# EAGLE design ir_ring_2019_05 (EAGLE 6.5.0)
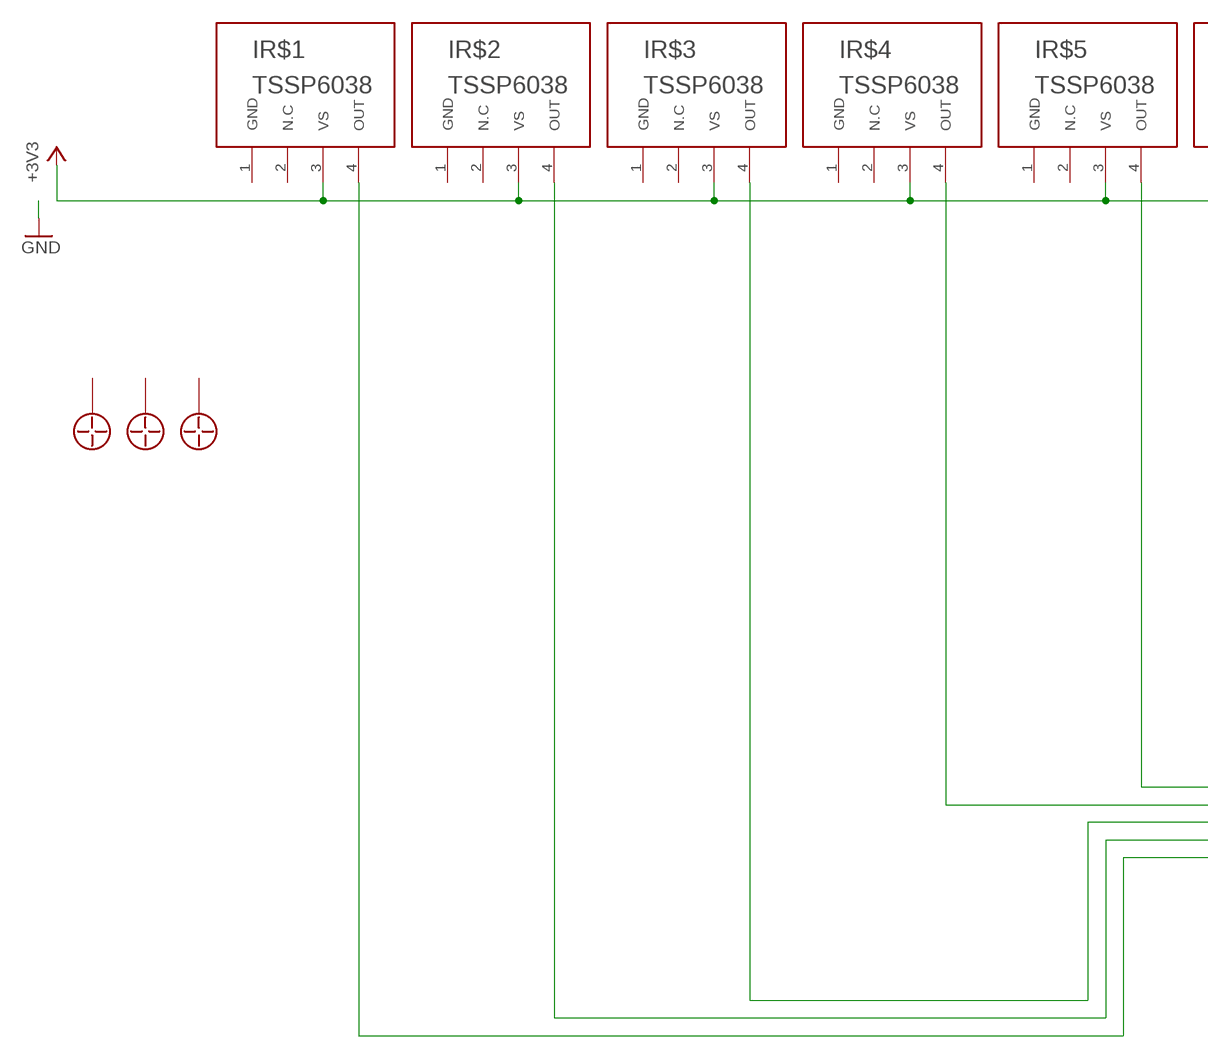
[diagram p0: schematic, sheet 1, part 1 of 2]
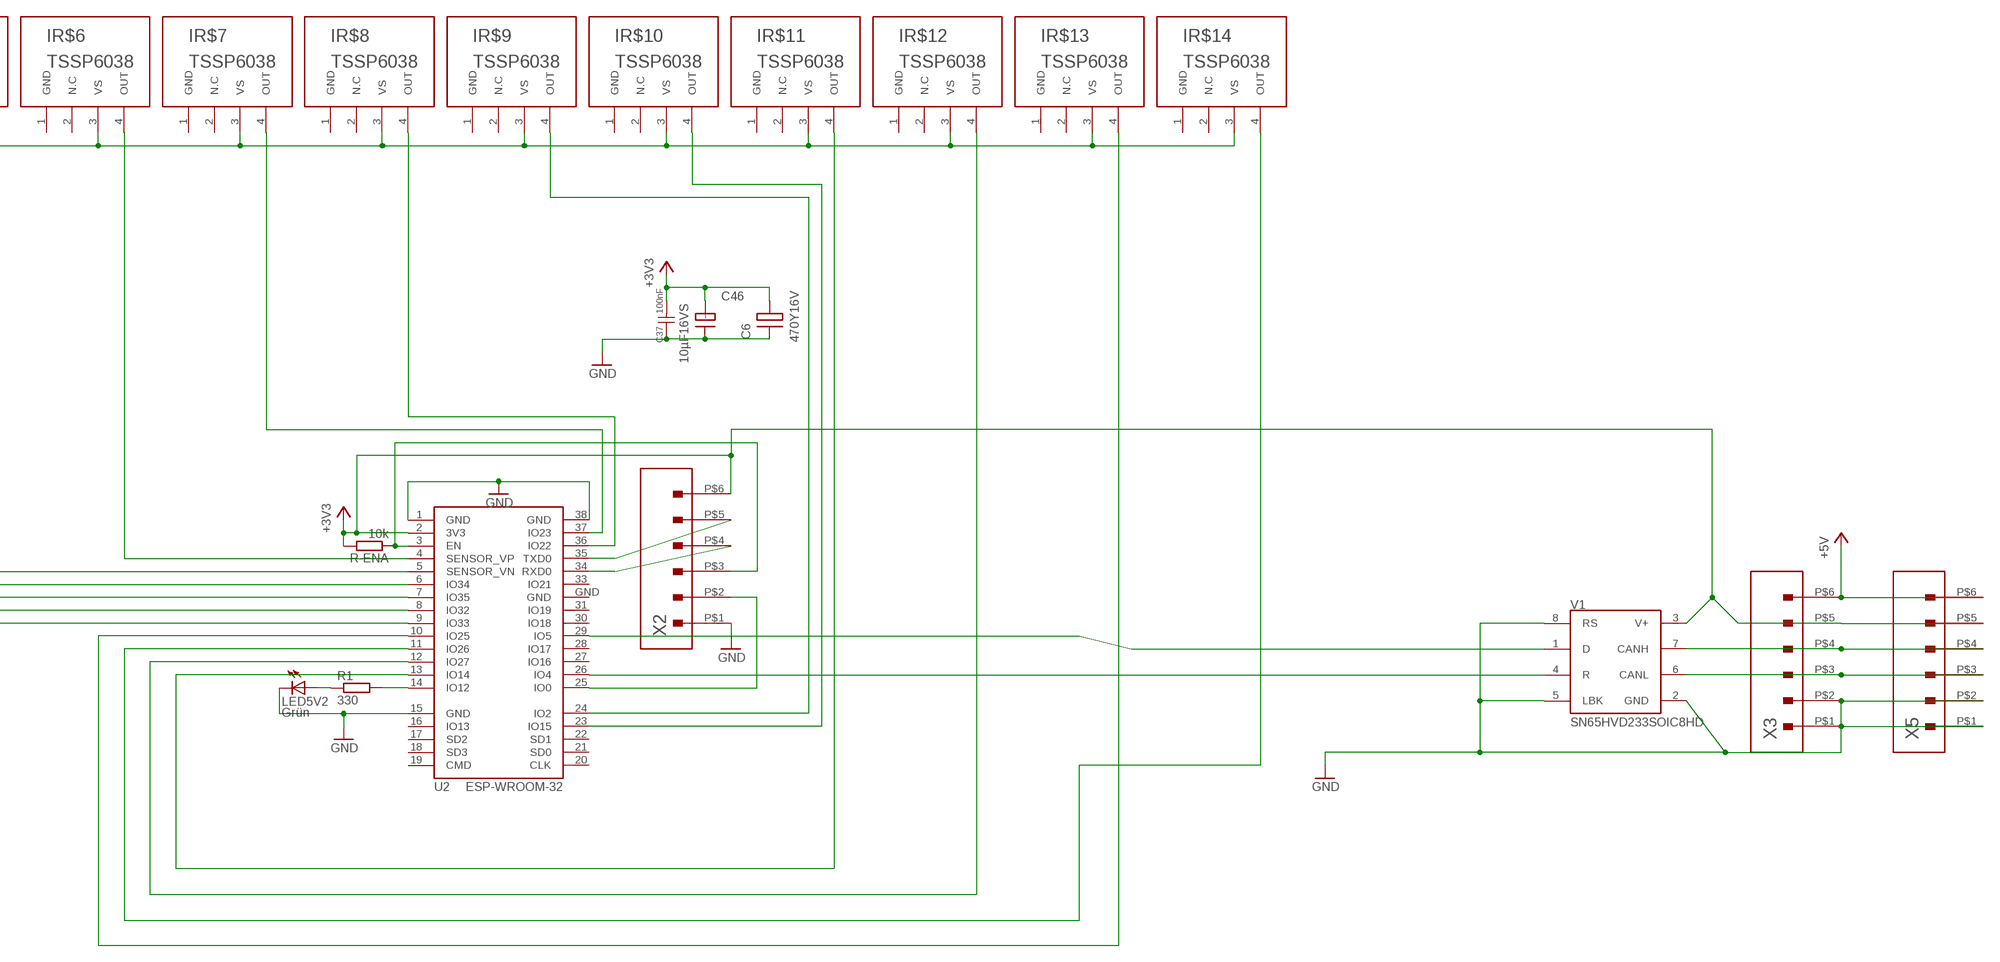
[diagram p1: schematic, sheet 1, part 2 of 2]

## Parts
C6  470Y16V  [150CLZ-1010]
C37  100nF  C0805  [0805]
C46  10µF16VS  [TANTALC]
IR$1  TSSP6038  [TSSP6038]
IR$2  TSSP6038  [TSSP6038]
IR$3  TSSP6038  [TSSP6038]
IR$4  TSSP6038  [TSSP6038]
IR$5  TSSP6038  [TSSP6038]
IR$6  TSSP6038  [TSSP6038]
IR$7  TSSP6038  [TSSP6038]
IR$8  TSSP6038  [TSSP6038]
IR$9  TSSP6038  [TSSP6038]
IR$10  TSSP6038  [TSSP6038]
IR$11  TSSP6038  [TSSP6038]
IR$12  TSSP6038  [TSSP6038]
IR$13  TSSP6038  [TSSP6038]
IR$14  TSSP6038  [TSSP6038]
LED5V2  Grün  LEDCHIP-LED0805  [CHIP-LED0805]
PM1  SMD-PASSER-1MMR  [SMD-PASSER-1MMR]
PM2  SMD-PASSER-1MMR  [SMD-PASSER-1MMR]
PM3  SMD-PASSER-1MMR  [SMD-PASSER-1MMR]
R1  330  R-EU_R0805  [R0805]
R-ENA  10k  R-EU_R0805  [R0805]
U2  ESP-WROOM-32  [ESP-WROOM-32]
V1  SN65HVD233SOIC8HD  [SO08]
X2  MOLEX104078-0610  [MOLEX104078-0610]
X3  MOLEX104078-0610  [MOLEX104078-0610]
X5  MOLEX104078-0610  [MOLEX104078-0610]

## Nets
+3V3: C6.+ C37.1 C46.+ IR$1.3(VS) IR$2.3(VS) IR$3.3(VS) IR$4.3(VS) IR$5.3(VS) IR$6.3(VS) IR$7.3(VS) IR$8.3(VS) IR$9.3(VS) IR$10.3(VS) IR$11.3(VS) IR$12.3(VS) IR$13.3(VS) IR$14.3(VS) R-ENA.2 U2.2(3V3) V1.3(V+) X2.P$6 X3.P$5 X5.P$5
+5V: X3.P$6 X5.P$6
GND: C6.- C37.2 C46.- LED5V2.C U2.1(GND) U2.15(GND) U2.38(GND) V1.2(GND) V1.5(LBK) V1.8(RS) X2.P$1 X3.P$1 X3.P$2 X5.P$1 X5.P$2
N$1: IR$3.4(OUT) U2.7(IO35)
N$2: IR$2.4(OUT) U2.8(IO32)
N$3: IR$1.4(OUT) U2.9(IO33)
N$4: IR$12.4(OUT) U2.12(IO27)
N$5: IR$11.4(OUT) U2.13(IO14)
N$6: IR$10.4(OUT) U2.23(IO15)
N$7: IR$9.4(OUT) U2.24(IO2)
N$8: IR$13.4(OUT) U2.10(IO25)
N$9: IR$6.4(OUT) U2.4(SENSOR_VP)
N$10: IR$5.4(OUT) U2.5(SENSOR_VN)
N$11: IR$4.4(OUT) U2.6(IO34)
N$12: IR$7.4(OUT) U2.37(IO23)
N$13: IR$8.4(OUT) U2.36(IO22)
N$14: U2.26(IO4) V1.4(R)
N$15: U2.29(IO5) V1.1(D)
N$17: V1.7(CANH) X3.P$4 X5.P$4
N$18: V1.6(CANL) X3.P$3 X5.P$3
N$20: LED5V2.A R1.1
N$21: R1.2 U2.14(IO12)
N$33: R-ENA.1 U2.3(EN) X2.P$3
N$35: U2.25(IO0) X2.P$2
RX: U2.34(RXD0) X2.P$4
TX: U2.35(TXD0) X2.P$5
WS6: IR$14.4(OUT) U2.11(IO26)
Unconnected: IR$1.2(N.C) IR$2.2(N.C) IR$3.2(N.C) IR$4.2(N.C) IR$5.2(N.C) IR$6.2(N.C) IR$7.2(N.C) IR$8.2(N.C) IR$9.2(N.C) IR$10.2(N.C) IR$11.2(N.C) IR$12.2(N.C) IR$13.2(N.C) IR$14.2(N.C) PM1.P$1 PM2.P$1 PM3.P$1 U2.16(IO13) U2.17(SD2) U2.18(SD3) U2.19(CMD) U2.20(CLK) U2.21(SD0) U2.22(SD1) U2.27(IO16) U2.28(IO17) U2.30(IO18) U2.31(IO19) U2.33(IO21)

## Power pins joined to a net without a drawn wire
GND: IR$1.1(GND) IR$2.1(GND) IR$3.1(GND) IR$4.1(GND) IR$5.1(GND) IR$6.1(GND) IR$7.1(GND) IR$8.1(GND) IR$9.1(GND) IR$10.1(GND) IR$11.1(GND) IR$12.1(GND) IR$13.1(GND) IR$14.1(GND) U2.GND

## Library data of the parts
C6 = ELKO_SMD:470Y16V: 470uF 16V 10x10,5mm
C37 = KONDENSA:C0805
C46 = ELKO:10µF16V
IR$1-IR$14 = IC:TSSP6038
LED5V2 = led:LED: LED OSRAM: - CHIPLED LG R971, LG N971, LY N971, LG Q971, LY Q971, LO R971, LY R971 LH N974, LH R974 LS Q976, LO Q976, LY Q976 LO Q996 - Hyper CHIPLED LW Q18S LB Q993, LB Q99A, LB R99A - SideLED LS A670, LO A670, LY A670, LG A670, LP A670 LB A673, LV A673, LT A673, LW A673 LH A674 LY A675 LS A676, LA A676, LO A676, LY A676, LW A676 LS A679, LY A679, LG A679 - Hyper Micro SIDELED® LS Y876, LA Y876, LO Y876, LY Y876 LT Y87S - SmartLED LW L88C, LW L88S LB L89C, LB L89S, LG L890 LS L89K, LO L89K, LY L89K LS L896, LA L896, LO L896, LY L896 - TOPLED LS T670, LO T670, LY T670, LG T670, LP T670 LSG T670, LSP T670, LSY T670, LOP T670, LYG T670 LG T671, LOG T671, LSG T671 LB T673, LV T673, LT T673, LW T673 LH T674 LS T676, LA T676, LO T676, LY T676, LB T676, LH T676, LSB T676, LW T676 LB T67C, LV T67C, LT T67C, LS T67K, LO T67K, LY T67K, LW E67C LS E67B, LA E67B, LO E67B, LY E67B, LB E67C, LV E67C, LT E67C LW T67C LS T679, LY T679, LG T679 LS T770, LO T770, LY T770, LG T770, LP T770 LB T773, LV T773, LT T773, LW T773 LH T774 LS E675, LA E675, LY E675, LS T675 LS T776, LA T776, LO T776, LY T776, LB T776 LHGB T686 LT T68C, LB T68C - Hyper Mini TOPLED® LB M676 - Mini TOPLED Santana® LG M470 LS M47K, LO M47K, LY M47K Source: http://www.osram.convergy.de LUXEON: - LUMILED® LXK2-PW12-R00, LXK2-PW12-S00, LXK2-PW14-U00, LXK2-PW14-V00 LXK2-PM12-R00, LXK2-PM12-S00, LXK2-PM14-U00 LXK2-PE12-Q00, LXK2-PE12-R00, LXK2-PE12-S00, LXK2-PE14-T00, LXK2-PE14-U00 LXK2-PB12-K00, LXK2-PB12-L00, LXK2-PB12-M00, LXK2-PB14-N00, LXK2-PB14-P00, LXK2-PB14-Q00 LXK2-PR12-L00, LXK2-PR12-M00, LXK2-PR14-Q00, LXK2-PR14-R00 LXK2-PD12-Q00, LXK2-PD12-R00, LXK2-PD12-S00 LXK2-PH12-R00, LXK2-PH12-S00 LXK2-PL12-P00, LXK2-PL12-Q00, LXK2-PL12-R00 Source: www.luxeon.com KINGBRIGHT: KA-3528ASYC Source: www.kingbright.com
PM1-PM3 = VERSCHIE:SMD-PASSER-1MMR: SMD Passermarke 1mm rund
R1 R-ENA = rcl:R-EU_: RESISTOR, European symbol
U2 = esp32:ESP-WROOM-32: Espressif Systems ESP-WROOM-32
V1 = Treiber:SN65HVD233: CAN Transceiver, 3,3V
X2 X3 X5 = Roboter:MOLEX104078-0610

## Board
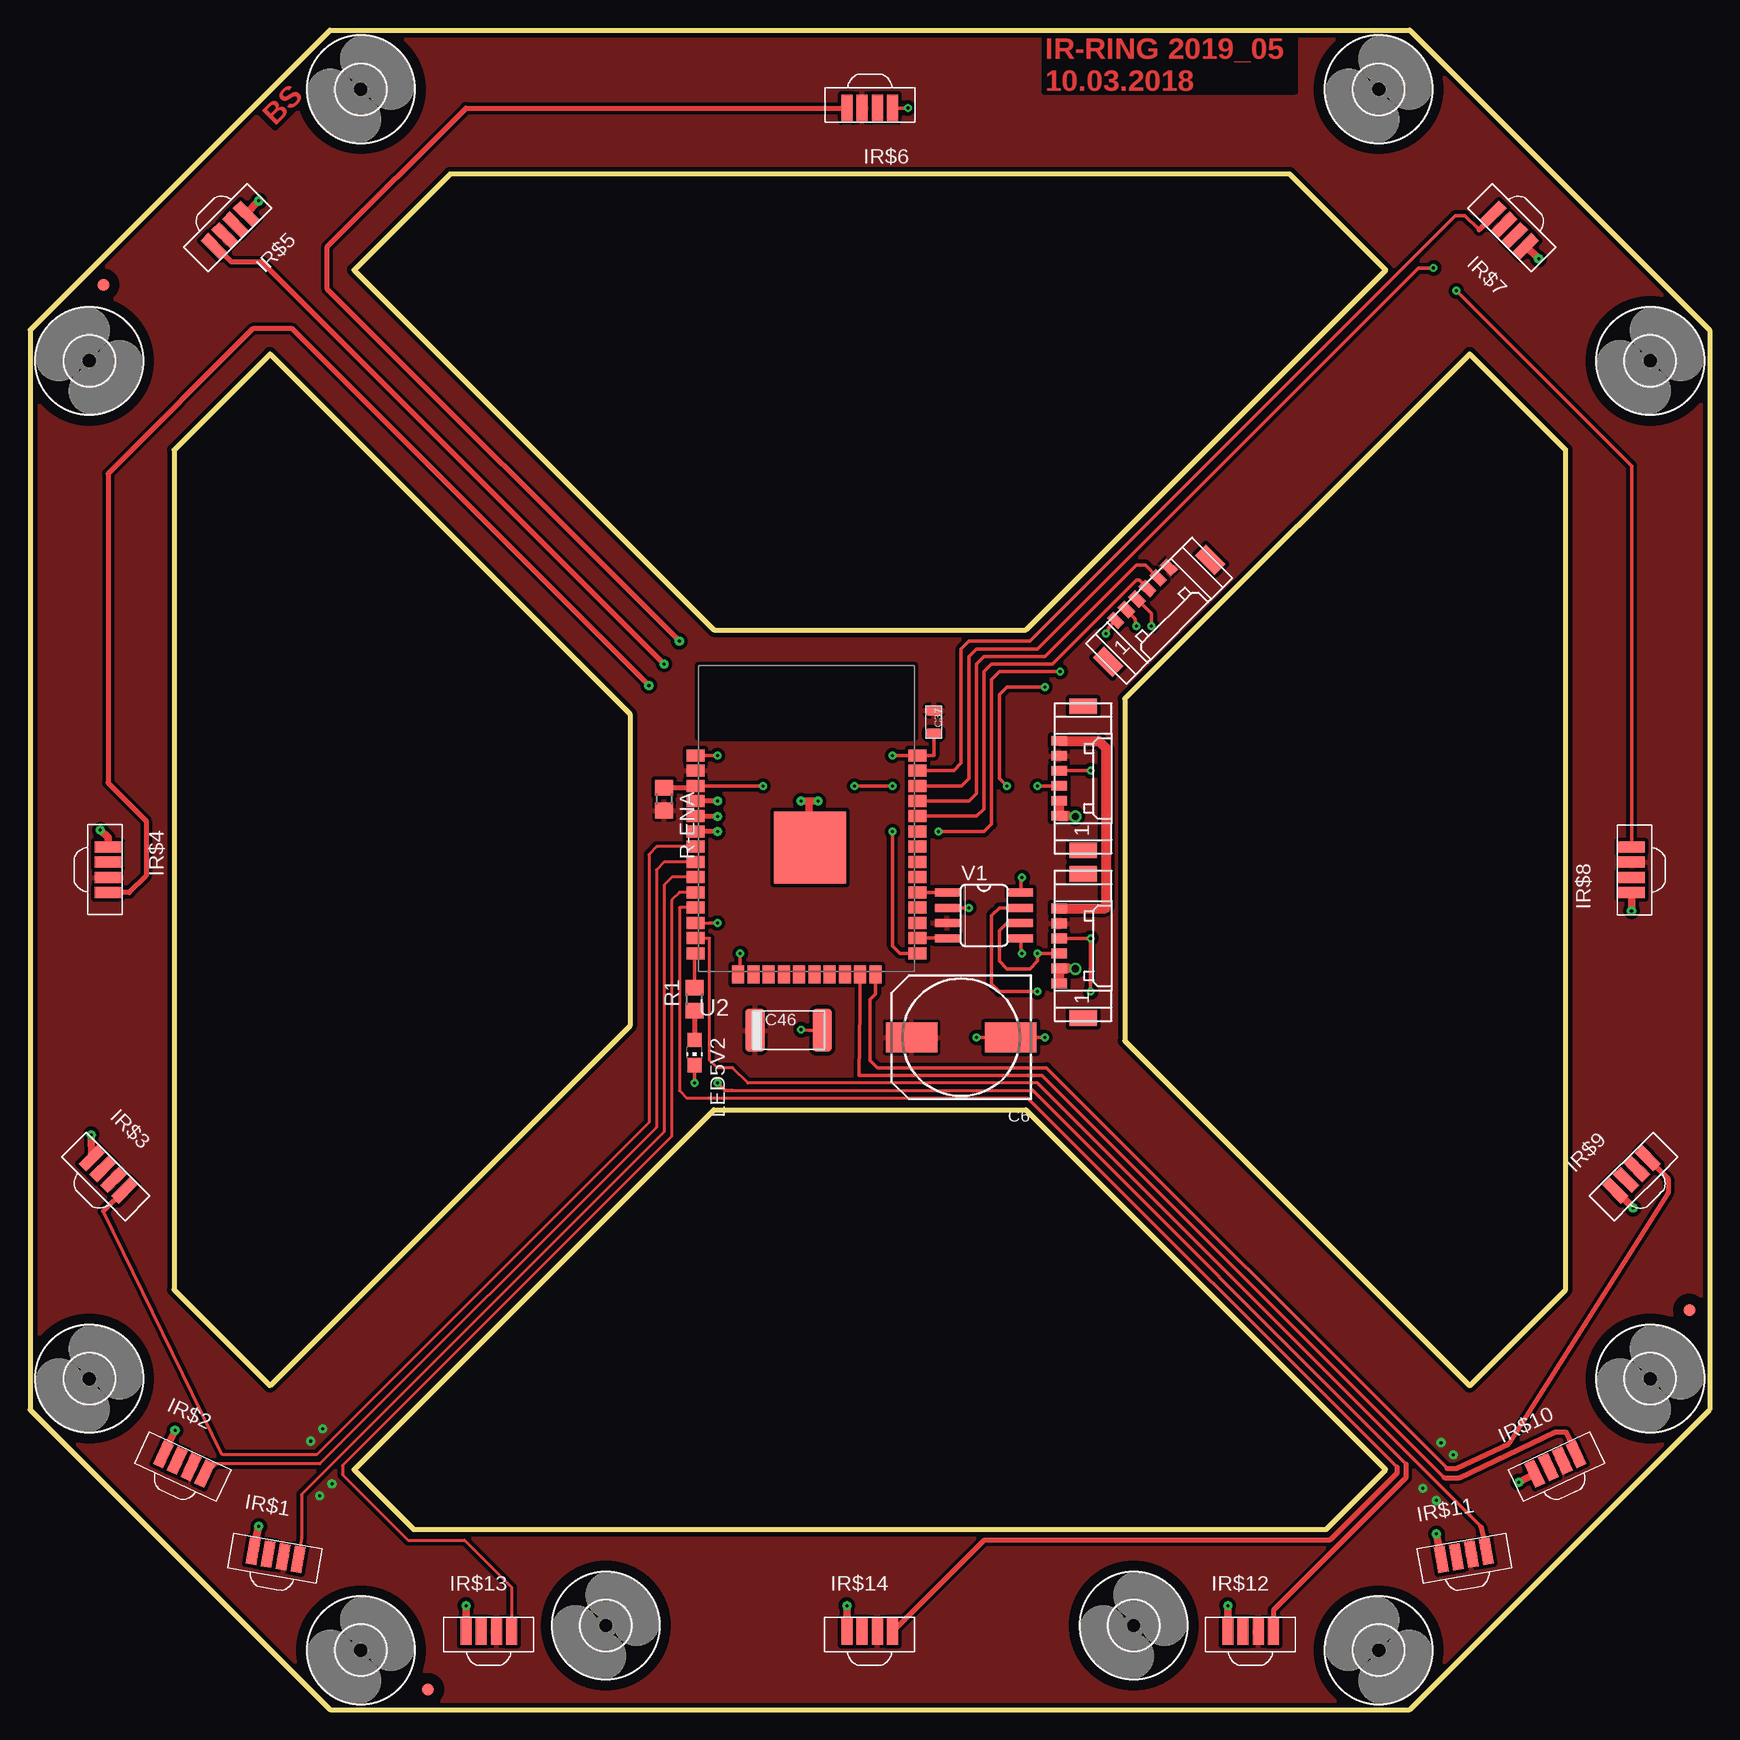
[diagram p2: board, top side]
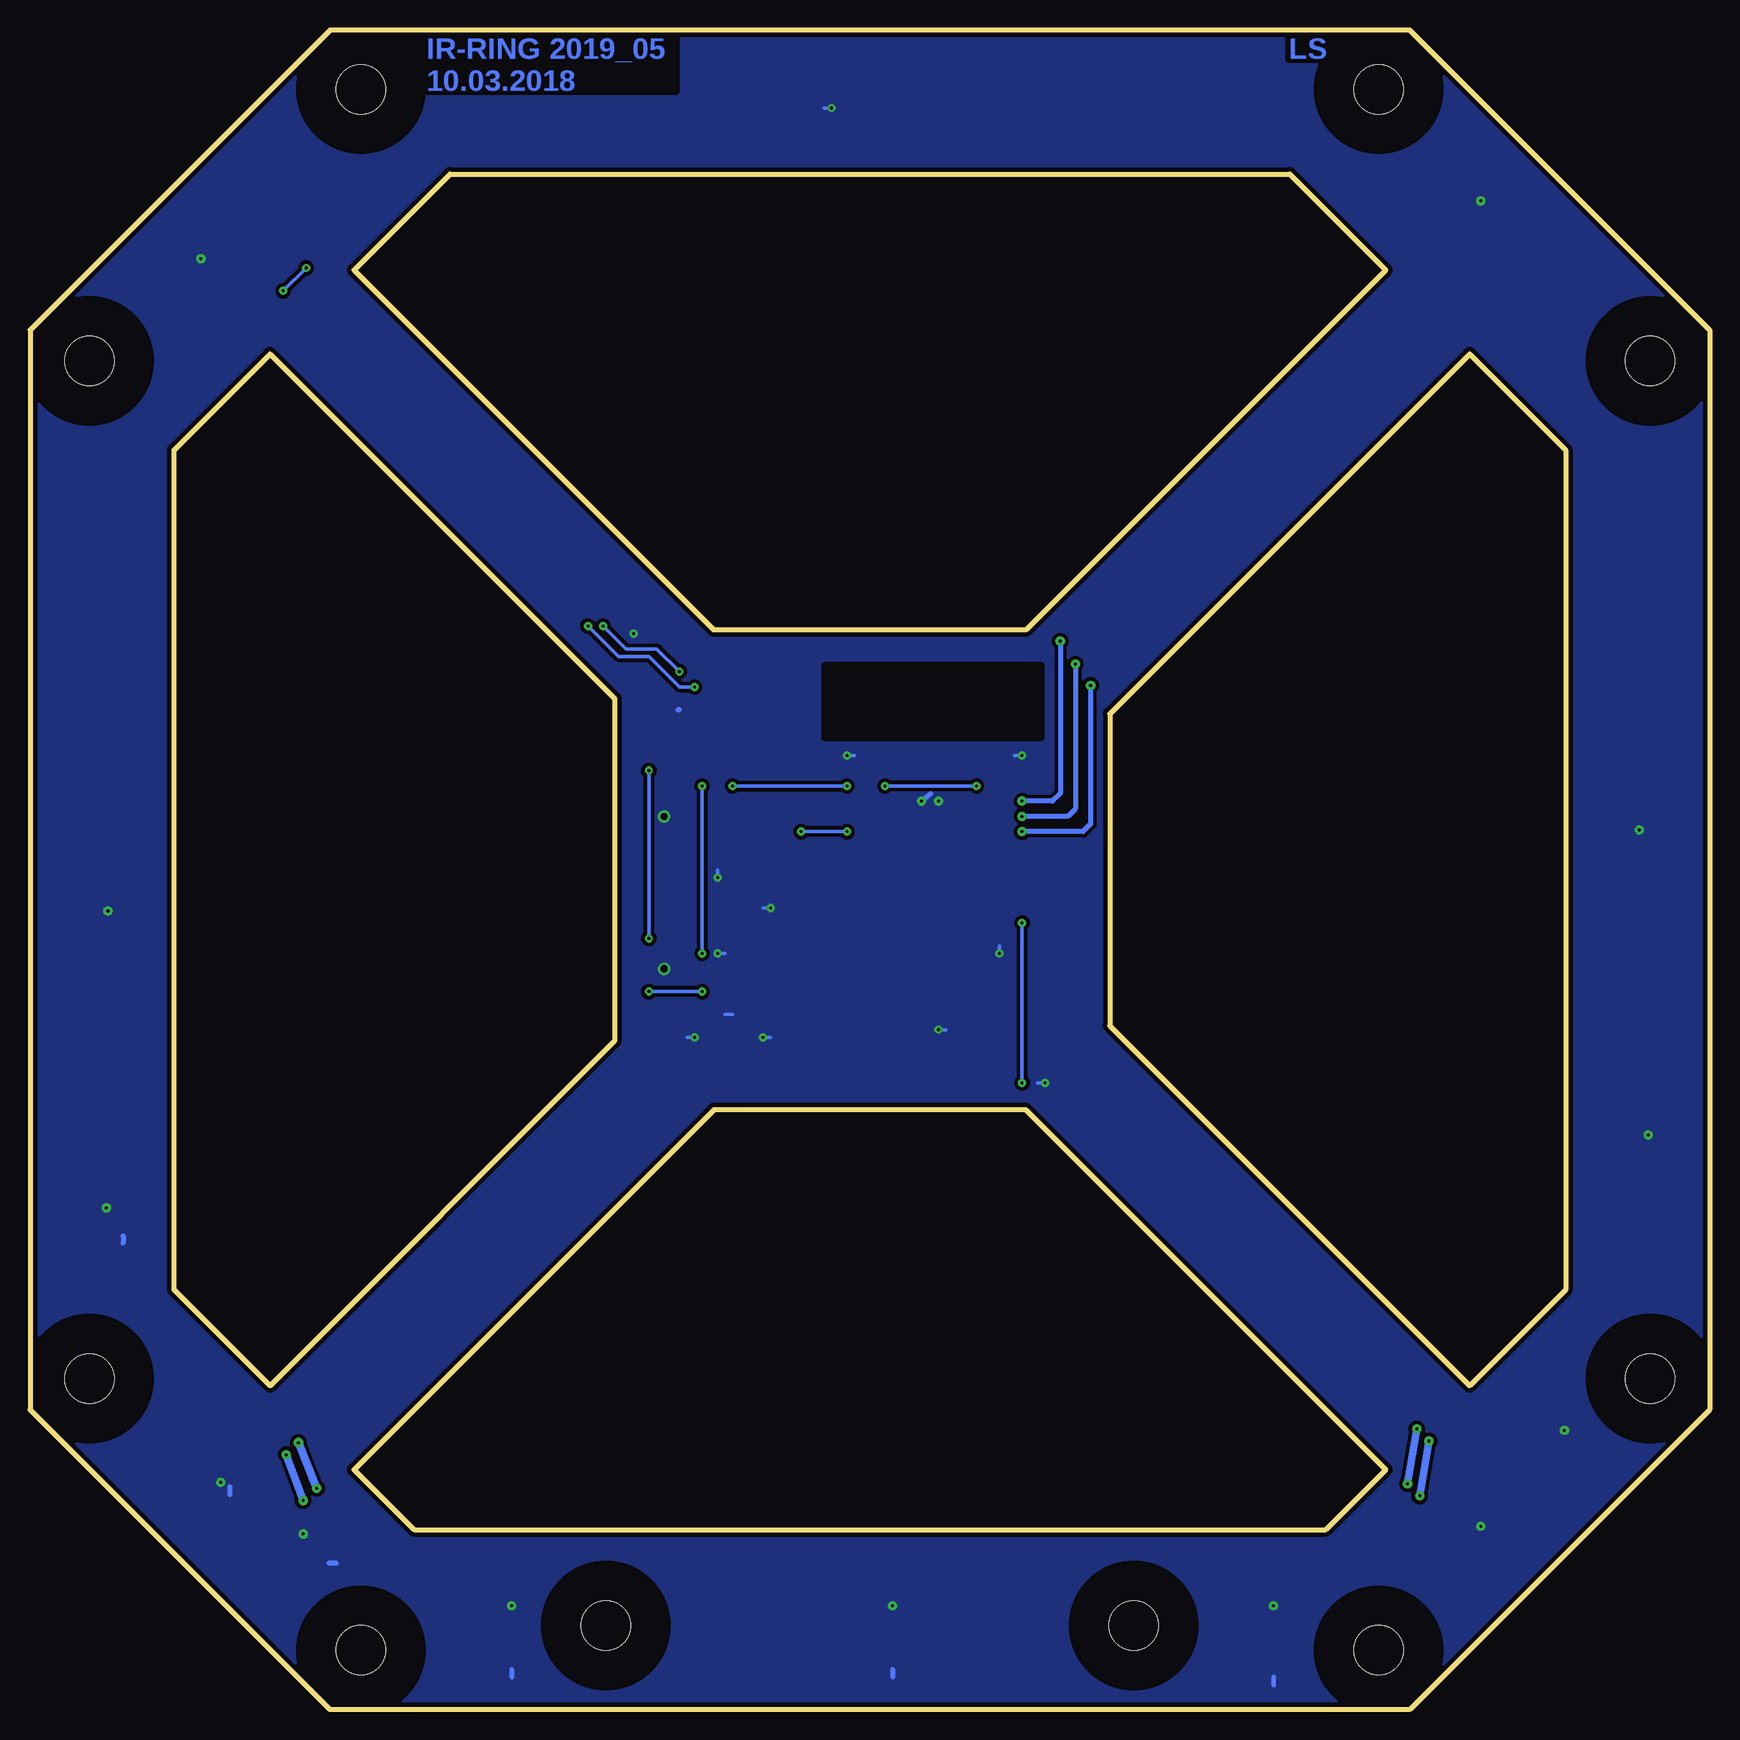
[diagram p3: board, bottom side, seen from below]

Size 140 x 140 mm. Coordinates in mm from the lower left corner, seen from the top.
Outline: 25,140 115,140 140,115 140,25 115,0 25,0 0,25 0,115 25,140
Outline: 108,15 32,15 27,20 57,50 83,50 113,20 108,15
Outline: 105,128 35,128 27,120 57,90 83,90 113,120 105,128
Outline: 12,105 12,35 20,27 50,57 50,83 20,113 12,105
Outline: 128,35 128,105 120,113 91.27,84.27 91.27,55.73 120,27 128,35
Copper layers (1*16): Top 0.035mm / dielectric 1.5mm / Bottom 0.035mm
Design rules "Normal-Pitch 2Layer": minimum track width 8mil, minimum drill 8mil, track to track 8mil, track to pad 8mil, pad to pad 8mil, via to via 8mil, smd to smd 8mil, copper to edge 15mil, drill to drill 8mil, minimum pad ring 10mil, minimum via ring 8mil, stop-mask expansion 0mil, vias tented up to drill 0mil, thermal gap 10mil

### Footprints (pad centres in the part's own frame; a part is rotated, then mirrored left to right if it is on the bottom)
150CLZ-1010 = smd 4.3 x 2.5: + 4.128,0; - -4.128,0
0805 = smd 0.864 x 1.397: 1 -0.953,0; 2 0.953,0
TANTALC = smd 1.6 x 3.6: + -2.8,0; - 2.8,0
4,1 = hole 4.1: 0,0
TSSP6038 = smd 0.9 x 2.2: 1 -1.905,0; 2 -0.635,0; 3 0.635,0; 4 1.905,0
CHIP-LED0805 = smd 1.2 x 1.2: A 0,-1.05; C 0,1.05
SMD-PASSER-1MMR = smd 1 x 1: P$1 0,0
R0805 = smd 1.3 x 1.5: 1 -0.95,0; 2 0.95,0
ESP-WROOM-32 = smd 1.5 x 1: 1 -9.25,7; 2 -9.25,5.73; 3 -9.25,4.46; 4 -9.25,3.19; 5 -9.25,1.92; 6 -9.25,0.65; 7 -9.25,-0.62; 8 -9.25,-1.89; 9 -9.25,-3.16; 10 -9.25,-4.43; 11 -9.25,-5.7; 12 -9.25,-6.97; 13 -9.25,-8.24; 14 -9.25,-9.51; 25 9.25,-9.51; 26 9.25,-8.24; 27 9.25,-6.97; 28 9.25,-5.7; 29 9.25,-4.43; 30 9.25,-3.16; 31 9.25,-1.89; 32 9.25,-0.62; 33 9.25,0.65; 34 9.25,1.92; 35 9.25,3.19; 36 9.25,4.46; 37 9.25,5.73; 38 9.25,7 | smd 1 x 1.5: 15 -5.7,-11.25; 16 -4.43,-11.25; 17 -3.16,-11.25; 18 -1.89,-11.25; 19 -0.62,-11.25; 20 0.65,-11.25; 21 1.92,-11.25; 22 3.19,-11.25; 23 4.46,-11.25; 24 5.73,-11.25 | smd 6 x 6: GND 0.3,-0.7
SO08 = smd 0.66 x 2.032: 1 -1.905,-3.073; 2 -0.635,-3.073; 3 0.635,-3.073; 4 1.905,-3.073; 5 1.905,3.073; 6 0.635,3.073; 7 -0.635,3.073; 8 -1.905,3.073
MOLEX104078-0610 = smd 0.8 x 1.3: P$1 -3.125,2; P$2 -1.875,2; P$3 -0.625,2; P$4 0.625,2; P$5 1.875,2; P$6 3.125,2 | smd 1.3 x 2.3: P$7 -6,0; P$8 6,0

### Placement (x,y rotation side)
C6  77.62,56.03 180 top
C37  75.33,82.32 270 top
C46  63.24,56.61 0 top
H1  MOUNT-HOLE4.1  [4,1]  112.43,135.05 0 top
H2  MOUNT-HOLE4.1  [4,1]  4.95,27.57 0 top
H3  MOUNT-HOLE4.1  [4,1]  4.95,112.43 90 top
H4  MOUNT-HOLE4.1  [4,1]  112.43,4.95 90 top
H5  MOUNT-HOLE4.1  [4,1]  27.57,135.05 0 top
H6  MOUNT-HOLE4.1  [4,1]  135.05,112.43 180 top
H7  MOUNT-HOLE4.1  [4,1]  135.05,27.57 180 top
H8  MOUNT-HOLE4.1  [4,1]  27.57,4.95 0 top
H9  MOUNT-HOLE4.1  [4,1]  48,7 0 top
H10  MOUNT-HOLE4.1  [4,1]  92,7 0 top
IR$1  20.47,12.85 350 top
IR$2  12.85,20.47 335 top
IR$3  6.5,44.6 315 top
IR$4  6.5,70 270 top
IR$5  16.66,123.34 225 top
IR$6  70,133.5 180 top
IR$7  123.34,123.34 135 top
IR$8  133.5,70 90 top
IR$9  133.5,44.6 45 top
IR$10  127.15,20.47 25 top
IR$11  119.53,12.85 10 top
IR$12  101.75,6.5 0 top
IR$13  38.25,6.5 0 top
IR$14  70,6.5 0 top
LED5V2  55.39,54.76 180 top
PM1  6.12,118.77 0 top
PM2  138.33,33.3 0 top
PM3  33.17,1.67 0 top
R1  55.39,59.2 90 top
R-ENA  52.86,75.89 270 top
U2  64.73,72.54 0 top
V1  79.53,66.19 270 top
X2  94.13,91.59 45 top
X3  87.78,63.65 90 top
X5  87.78,77.62 90 top

### Tracks (layer width: path | path; a pad name or v marks a point on that pad's centre or on a via)
+3V3  (via drill 0.25 pad 0.76)
  Bottom 0.61: v118.64,21.23 v117.24,17.42 | v117.62,22.25 v116.1,18.44 | v23.39,22.38 v24.15,17.8 | v24.41,23.39 v25.17,18.82
  pour Top (isolate 0.305, rank 2): -4.3,156.36 146.2,156.36 154.45,148.11 154.45,-0.48 151.28,-3.66 9.67,-3.66 -8.11,14.12 -8.11,152.55
+5V
  Top 0.813: X5.P$6 89.1,80.75 89.69,80.16 89.69,66.83 89.64,66.78 X3.P$6
GND  (via drill 0.25, 0.25 pad 0.76, 0.6)
  Top 0.305: U2.1 v57.3,79.54 v57.3,79.53 | v71.91,79.53 v71.91,79.54 U2.38 75.33,79.54 C37.2 | IR$6.1 v73.17,133.5 | 86.46,74.5 v87.14,74.44 | 86.48,61.77 v87.14,61.74 | V1.5 82.6,63.12 v82.7,63.02 | V1.8 82.6,69.26 v82.7,69.36 | V1.2 v78.25,66.83 | X2.P$1 90.03,90.32 v89.69,89.69 | U2.15 59.2,61.47 v59.2,63.02 | LED5V2.C v55.39,52.22 | C6.- v84.61,56.03 | C46.- 64.97,56.61 v64.28,56.66 | C6.- v78.89,56.03 | C6.- 82.06,56.03
  Top 0.61: IR$13.1 v36.34,8.66 | IR$14.1 v68.09,8.66 | IR$12.1 v99.84,8.66 | IR$11.1 v117.24,14.63 | IR$10.1 v124.1,18.95 | IR$9.1 v133.63,41.81 | IR$8.1 v133.5,66.57 | IR$2.1 v12.09,23.26 | IR$1.1 v19.07,15.26 | IR$3.1 v5.1,47.9 | IR$4.1 6.5,72.67 v5.86,73.3 | IR$5.1 | IR$5.1 v19.07,125.75 | IR$7.1 | IR$7.1 v125.75,120.93 | v65.68,75.72 64.92,75.72 | 64.92,75.72 v64.28,75.72 | U2.GND 64.92,71.95 64.92,75.72
  Top 0.813: X5.P$2 X5.P$1 86.46,74.5 | X3.P$1 X3.P$2 86.48,61.77
  Bottom 0.305: v57.3,79.53 57.94,79.53 | v71.91,79.53 71.27,79.53 | v73.17,133.5 73.81,133.5 | v82.7,63.02 82.06,63.02 | v82.7,69.36 82.7,70 | v78.25,66.83 78.89,66.83 | v59.2,63.02 59.2,63.65 | v55.39,52.22 56.03,52.22 | v84.61,56.03 85.24,56.03 | v64.28,56.66 63.65,56.66 | v78.89,56.03 78.25,56.03 | 82.06,57.94 81.43,57.94
  Bottom 0.406: 132.23,39.52 132.23,38.89 | 123.34,18.56 123.34,17.93 | 115.09,12.22 114.45,12.22 | 99.84,3.33 99.84,2.69 | 68.09,3.33 68.09,2.69 | 36.34,2.69 36.34,2.06 | v65.68,75.72 64.92,76.35 | 85.88,83.34 86,83.34
  pour Bottom (isolate 0.305): -32.23,70 arc-90 70,172.24 arc-90 172.24,70 arc-90 70,-32.23 arc-90
N$1
  Top 0.254: 6.12,41.55 16.02,21.23 23.9,21.23 51.59,48.92 51.59,71.27 52.23,71.92 U2.7
  Top 0.406: 6.12,41.55 IR$3.4
N$2
  Top 0.254: 15.38,20.47 24.15,20.47 52.22,48.54 52.22,70 52.87,70.65 U2.8
  Top 0.406: 15.38,20.47 IR$2.4
N$3
  Top 0.254: IR$1.4 22.63,14.37 22.63,17.93 52.86,48.16 52.86,68.73 53.5,69.38 U2.9
N$4  (via drill 0.25)
  Top 0.254: 58.57,51.59 83.59,51.59 | U2.12 56.65,65.57
  Top 0.305: 83.59,51.59 114.7,20.47 | 56.65,65.57 57.3,65.57 v57.3,65.56 | v57.3,52.22 57.94,51.59 58.57,51.59
  Top 0.406: 114.7,20.47 114.7,19.33 103.66,8.28 IR$12.4
  Bottom 0.305: v57.3,65.56 v57.3,52.22
N$5
  Top 0.254: 83.97,52.22 59.84,52.22 58.57,53.49 57.3,53.49 56.66,54.12 56.66,64.28 55.49,64.28
  Top 0.305: 83.97,52.22 120.93,15.26
  Top 0.406: 120.93,15.26 IR$11.4 | 55.49,64.28 U2.13
N$6
  Top 0.305: U2.23 69.19,58.49 69.11,52.86 84.35,52.86 117.88,19.33
  Top 0.406: 117.88,19.33 119.15,19.33 127.15,23.14 128.04,23.14 IR$10.4
N$7
  Top 0.305: 118.13,20.09 84.73,53.49 70.76,53.49 70.64,53.49 70,54.12 70,59.2 70.46,59.66 U2.24
  Top 0.406: 118.13,20.09 118.9,20.09 123.25,22.15 136.55,43.08 136.55,44.22 IR$9.4
N$8
  Top 0.254: IR$13.4 40.16,10.18 36.22,14.12 31.52,14.12 26.06,19.58 26.06,20.34 53.49,47.77 53.49,67.46 54.14,68.11 U2.10
N$9  (via drill 0.25 pad 0.76)
  Top 0.406: v57.3,75.72 55.49,75.72 U2.4 | v54.12,89.05 24.79,118.39 24.79,121.94 36.34,133.5 IR$6.4
  Bottom 0.406: v54.12,89.05 54.12,76.35 54.76,75.72 v57.3,75.72
N$10  (via drill 0.25 pad 0.76)
  Top 0.406: IR$5.4 15.47,121.99 16.79,120.67 19.33,120.67 v52.86,87.14 | v57.3,74.44 55.49,74.44 U2.5
  Bottom 0.406: v52.86,87.14 52.86,75.08 53.49,74.44 v57.3,74.44
N$11  (via drill 0.25 pad 0.76)
  Top 0.406: v57.3,73.17 55.49,73.17 U2.6 | v51.59,85.37 21.87,115.09 18.56,115.09 6.5,103.02 6.5,77.24 9.67,74.06 9.67,69.49 8.28,68.09 IR$4.4
  Bottom 0.406: v51.59,85.37 51.59,73.81 52.22,73.17 v57.3,73.17
N$12
  Top 0.305: 120.8,123.34 119.61,124.53 118.82,124.53 83.34,89.05 78.25,89.05 77.62,88.41 77.62,78.89 77,78.27 U2.37
  Top 0.406: IR$7.4 121.99,124.53 120.8,123.34
N$13  (via drill 0.25)
  Top 0.305: IR$8.4 133.5,103.66 v118.9,118.26 | U2.36 77.64,77 78.25,77.62 78.25,87.78 78.89,88.41 83.97,88.41 115.72,120.16 v116.99,120.16
  Bottom 0.305: v116.99,120.16 v118.9,118.26
N$14
  Top 0.305: U2.26 76.44,64.3 V1.4
N$15
  Top 0.305: U2.29 76.44,68.11 V1.1
N$17  (via drill 0.25)
  Top 0.305: X3.P$4 87.77,64.28 v88.41,64.28 v88.41,59.84 | v88.41,78.25 X5.P$4 | V1.7 80.8,66.83 80.16,66.19 80.16,60.48 80.8,59.84 v83.97,59.84
  Bottom 0.305: v88.41,64.28 v88.41,78.25 | v83.97,59.84 v88.41,59.84
N$18  (via drill 0.25)
  Top 0.305: X5.P$3 v83.98,77 v83.97,76.98 | X3.P$3 85.77,63.02 v83.97,63.02 83.97,62.38 83.34,61.74 81.43,61.74 80.8,62.38 80.8,64.92 81.43,65.56 V1.6
  Bottom 0.305: v83.97,76.98 v83.97,63.02
N$20
  Top 0.406: R1.1 LED5V2.A
N$21
  Top 0.305: U2.14 55.39,62.95 R1.2
N$33  (via drill 0.25)
  Top 0.305: U2.3 61.09,77 v61.11,76.98 | X2.P$3 93.5,91.34 v93.5,90.32 | v84.61,85.24 81.43,85.24 80.8,84.61 80.8,77.62 v81.43,76.98 | v71.91,76.98 v68.73,76.98
  Top 0.406: R-ENA.1 55.32,76.84 U2.3
  Bottom 0.305: v61.11,76.98 v68.73,76.98 | v93.5,90.32 90.95,87.78 88.41,87.78 85.88,85.24 v84.61,85.24 | v81.43,76.98 v71.91,76.98
N$35  (via drill 0.25)
  Top 0.305: U2.25 72.53,63.03 71.91,63.65 v71.91,73.17 | 91.59,91.48 X2.P$2 92.11,90.95 v92.22,90.32 | v75.72,73.17 79.53,73.17 80.16,73.81 80.16,85.88 80.8,86.51 v85.88,86.51
  Bottom 0.305: v71.91,73.17 v75.72,73.17 | v92.22,90.32 90.32,88.41 87.78,88.41 v85.88,86.51
RX
  Top 0.305: U2.34 78.91,74.46 79.53,75.08 79.53,86.51 80.16,87.14 85.24,87.14 92.22,94.13 92.47,94.13 X2.P$4
  Top 0.61: 74,74.44 U2.34
TX
  Top 0.305: U2.35 78.27,75.73 78.89,76.35 78.89,87.14 79.53,87.78 84.61,87.78 92.22,95.4 92.97,95.4 X2.P$5
WS6
  Top 0.254: 83.21,50.95 54.76,50.95 54.12,51.59 54.12,66.83 54.14,66.84 U2.11
  Top 0.305: 83.21,50.95 113.94,20.22
  Top 0.406: 113.94,20.22 113.94,19.71 108.35,14.12 79.53,14.12 IR$14.4

### Text on the board
Top: IR-RING 2019_05 / 10.03.2018 | BS
Bottom: LS | IR-RING 2019_05 / 10.03.2018